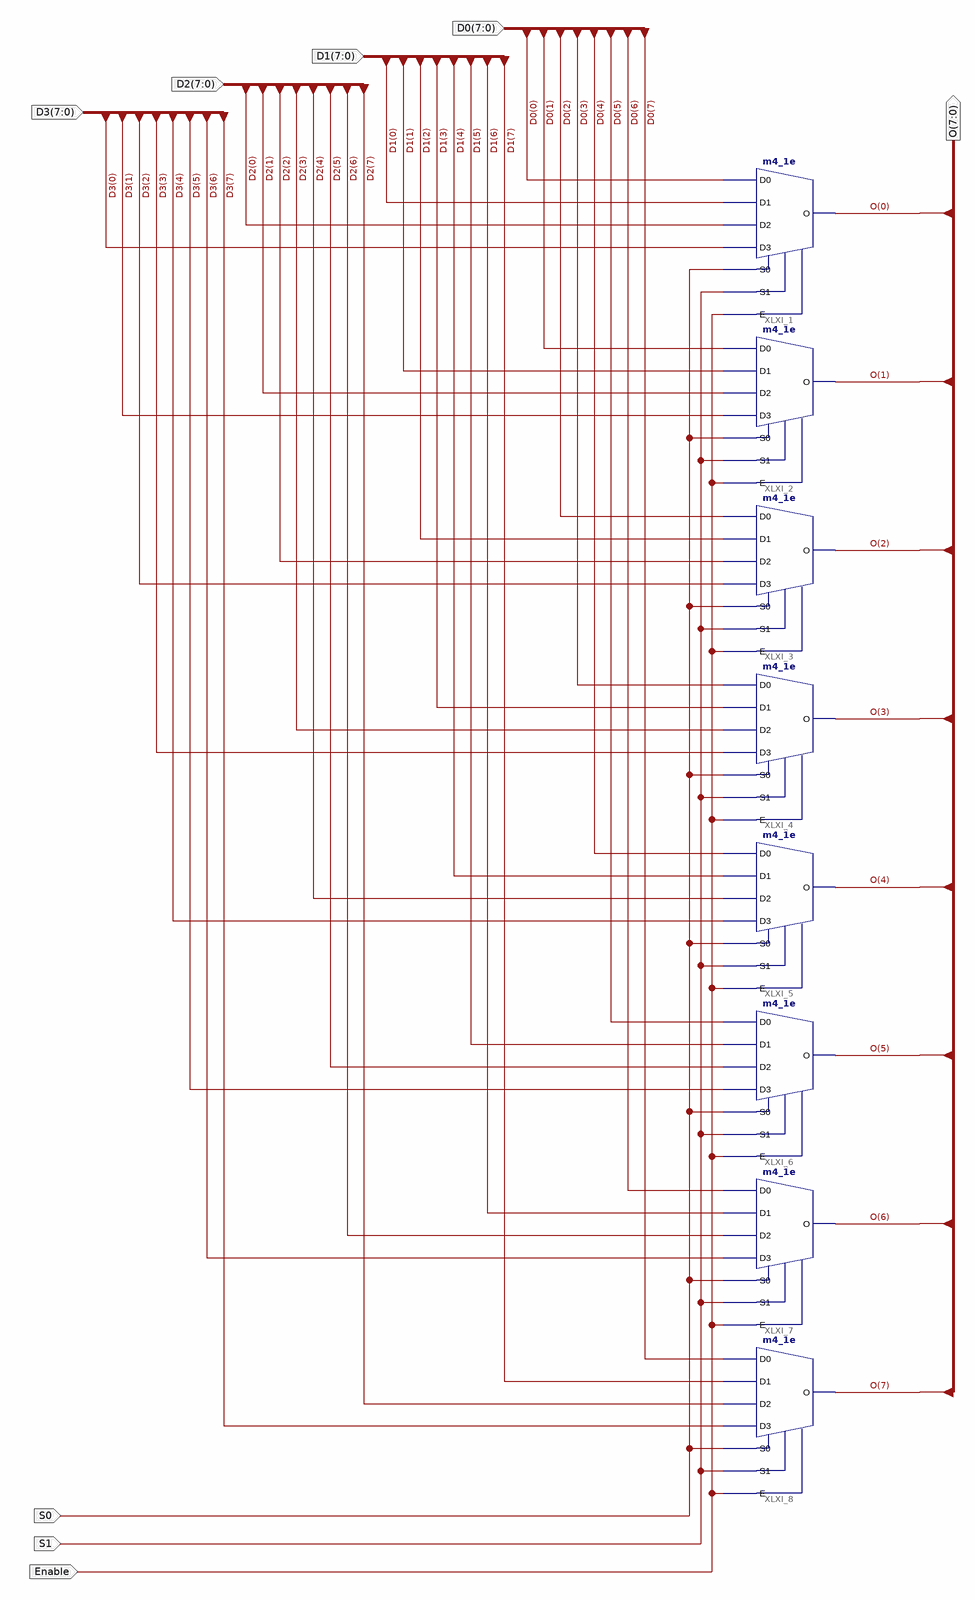
[diagram p0: schematic sheet 1]
// Xilinx ISE schematic mux4x1x8e.sch (spartan6) as structural Verilog: 8 symbols, 8 ports
module mux4x1x8e (
  input  [7:0] D3,
  input  [7:0] D2,
  input  [7:0] D1,
  input  [7:0] D0,
  input  Enable,
  input  S0,
  input  S1,
  output [7:0] O
);

  m4_1e XLXI_1 (.D0(D0[0]), .D1(D1[0]), .D2(D2[0]), .D3(D3[0]), .E(Enable), .S0(S0), .S1(S1), .O(O[0]));
  m4_1e XLXI_2 (.D0(D0[1]), .D1(D1[1]), .D2(D2[1]), .D3(D3[1]), .E(Enable), .S0(S0), .S1(S1), .O(O[1]));
  m4_1e XLXI_3 (.D0(D0[2]), .D1(D1[2]), .D2(D2[2]), .D3(D3[2]), .E(Enable), .S0(S0), .S1(S1), .O(O[2]));
  m4_1e XLXI_4 (.D0(D0[3]), .D1(D1[3]), .D2(D2[3]), .D3(D3[3]), .E(Enable), .S0(S0), .S1(S1), .O(O[3]));
  m4_1e XLXI_5 (.D0(D0[4]), .D1(D1[4]), .D2(D2[4]), .D3(D3[4]), .E(Enable), .S0(S0), .S1(S1), .O(O[4]));
  m4_1e XLXI_6 (.D0(D0[5]), .D1(D1[5]), .D2(D2[5]), .D3(D3[5]), .E(Enable), .S0(S0), .S1(S1), .O(O[5]));
  m4_1e XLXI_7 (.D0(D0[6]), .D1(D1[6]), .D2(D2[6]), .D3(D3[6]), .E(Enable), .S0(S0), .S1(S1), .O(O[6]));
  m4_1e XLXI_8 (.D0(D0[7]), .D1(D1[7]), .D2(D2[7]), .D3(D3[7]), .E(Enable), .S0(S0), .S1(S1), .O(O[7]));
endmodule
